# EAGLE design Osmofl2k_adapter_zmatch (EAGLE 7.5.0)
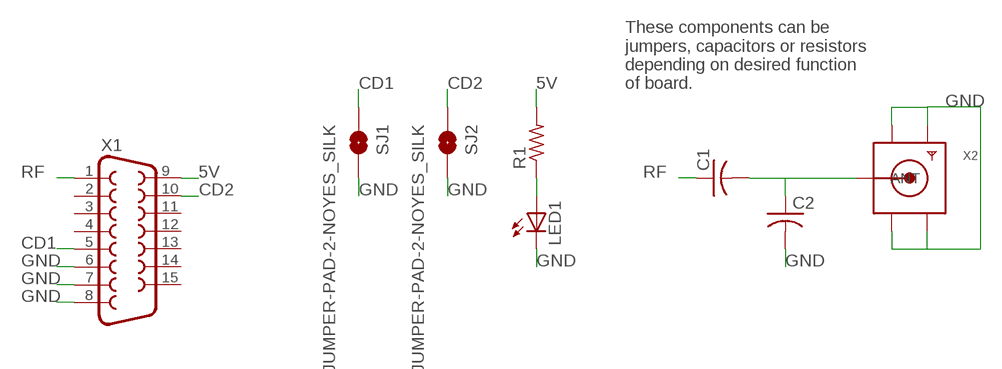
[diagram p0: schematic, sheet 1]

## Parts
C1  C-USC0603  [C0603]
C2  C-USC0603  [C0603]
LED1  LEDCHIPLED_0805  [CHIPLED_0805]
R1  R-US_R0805  [R0805]
SJ1  JUMPER-PAD-2-NOYES_SILK  [PAD-JUMPER-2-NO_YES_SILK]
SJ2  JUMPER-PAD-2-NOYES_SILK  [PAD-JUMPER-2-NO_YES_SILK]
X1  F15HDH  [HDF15H]
X2  SMACONNECTOR_EDGE  [SMA_EDGELAUNCH]

## Nets
5V: R1.2 X1.9
CD1: SJ1.1 X1.5
CD2: SJ2.1 X1.10
GND: C2.2 LED1.C SJ1.2 SJ2.2 X1.6 X1.7 X1.8 X2.GND@1(GND4) X2.GND@2(GND3) X2.GND@3(GND2) X2.GND@4(GND1)
N$1: C1.2 C2.1 X2.P(ANT)
N$2: LED1.A R1.1
RF: C1.1 X1.1
Unconnected: X1.2 X1.3 X1.4 X1.11 X1.12 X1.13 X1.14 X1.15

## Notes on the sheet
- These components can be
  jumpers, capacitors or resistors
  depending on desired function
  of board.

## Library data of the parts
C1 C2 = adafruit:C-US: CAPACITOR, American symbol
LED1 = adafruit:LED: LED OSRAM: - CHIPLED LG R971, LG N971, LY N971, LG Q971, LY Q971, LO R971, LY R971 LH N974, LH R974 LS Q976, LO Q976, LY Q976 LO Q996 - Hyper CHIPLED LW Q18S LB Q993, LB Q99A, LB R99A - SideLED LS A670, LO A670, LY A670, LG A670, LP A670 LB A673, LV A673, LT A673, LW A673 LH A674 LY A675 LS A676, LA A676, LO A676, LY A676, LW A676 LS A679, LY A679, LG A679 - Hyper Micro SIDELED® LS Y876, LA Y876, LO Y876, LY Y876 LT Y87S - SmartLED LW L88C, LW L88S LB L89C, LB L89S, LG L890 LS L89K, LO L89K, LY L89K LS L896, LA L896, LO L896, LY L896 - TOPLED LS T670, LO T670, LY T670, LG T670, LP T670 LSG T670, LSP T670, LSY T670, LOP T670, LYG T670 LG T671, LOG T671, LSG T671 LB T673, LV T673, LT T673, LW T673 LH T674 LS T676, LA T676, LO T676, LY T676, LB T676, LH T676, LSB T676, LW T676 LB T67C, LV T67C, LT T67C, LS T67K, LO T67K, LY T67K, LW E67C LS E67B, LA E67B, LO E67B, LY E67B, LB E67C, LV E67C, LT E67C LW T67C LS T679, LY T679, LG T679 LS T770, LO T770, LY T770, LG T770, LP T770 LB T773, LV T773, LT T773, LW T773 LH T774 LS E675, LA E675, LY E675, LS T675 LS T776, LA T776, LO T776, LY T776, LB T776 LHGB T686 LT T68C, LB T68C - Hyper Mini TOPLED® LB M676 - Mini TOPLED Santana® LG M470 LS M47K, LO M47K, LY M47K Source: http://www.osram.convergy.de/
R1 = adafruit:R-US_: RESISTOR, American symbol
SJ1 SJ2 = SparkFun-Passives:JUMPER-PAD-2-NO
X1 = adafruit:F15: SUB-D HDH is also known as a 'right angle VGA' connector
X2 = adafruit:SMACONNECTOR: SMA Connector 90° DIP SMA Connector, 50 Ohm (4UConnector: 07259)

## Board
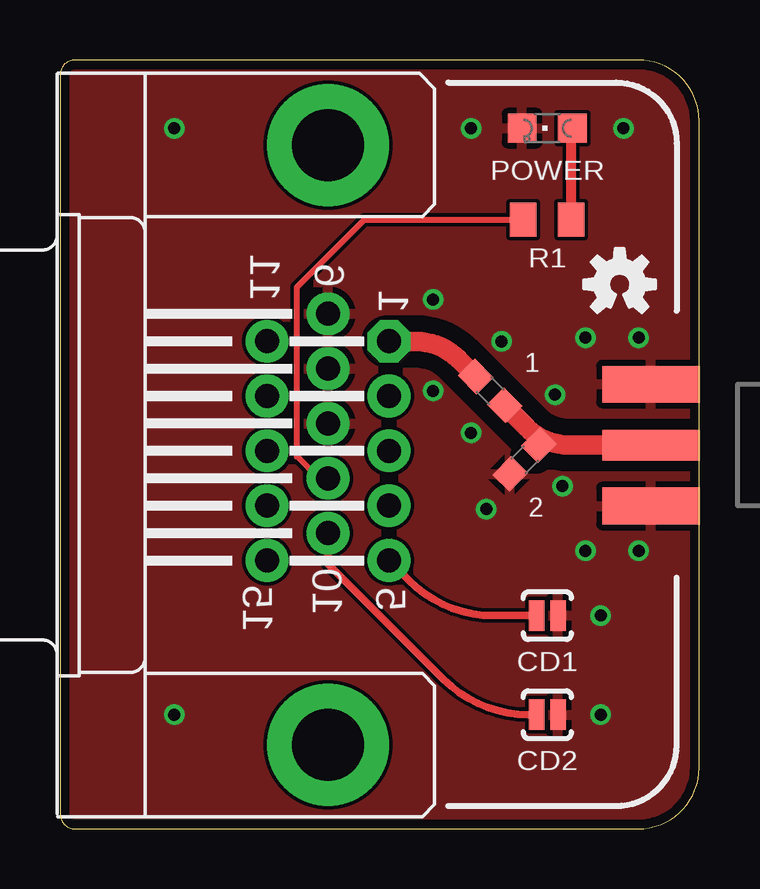
[diagram p1: board, top side]
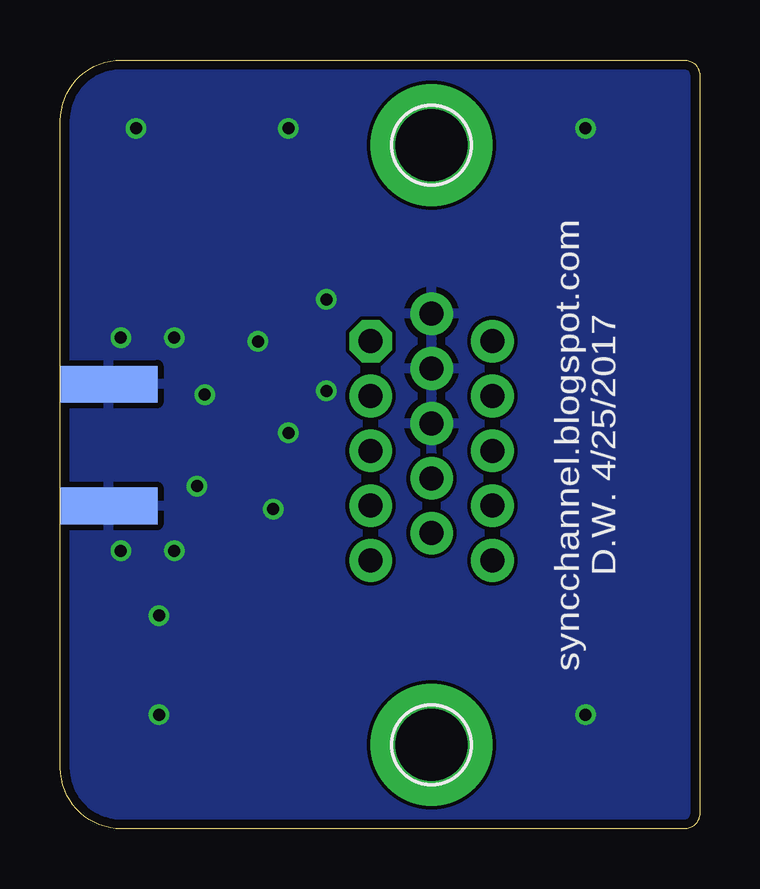
[diagram p2: board, bottom side, seen from below]

Size 26.65 x 32.05 mm. Coordinates in mm from the lower left corner, seen from the top.
Outline: 0,31.42 0,0.64 arc90 0.64,0 24.11,0 arc90 26.65,2.54 26.65,29.52 arc90 24.11,32.05 0.64,32.05 arc90 0,31.42
Copper layers (1*16): Top 0.0356mm / dielectric 1.5011mm / Bottom 0.0356mm
Design rules "LaenPCBOrder *": minimum track width 6mil, minimum drill 13mil, track to track 6mil, track to pad 6mil, pad to pad 6mil, via to via 6mil, smd to smd 6mil, copper to edge 15mil, drill to drill 6mil, minimum pad ring 7mil, minimum via ring 7mil, stop-mask expansion 3mil, vias tented up to drill 20mil, thermal gap 10mil
tRestrict: 6 lines

### Footprints (pad centres in the part's own frame; a part is rotated, then mirrored left to right if it is on the bottom)
C0603 = smd 1.1 x 1: 1 -0.85,0; 2 0.85,0
CHIPLED_0805 = smd 1.2 x 1.2: A 0,-1.05; C 0,1.05
R0805 = smd 1.1 x 1.4: 1 -1,0; 2 1,0
PAD-JUMPER-2-NO_YES_SILK = smd 0.635 x 1.27: 1 -0.45,0; 2 0.45,0
HDF15H = drill 1 pad 1.778 octagon: 1 4.329,2.54 | drill 1 pad 1.778: 2 2.043,2.54; 3 -0.243,2.54; 4 -2.529,2.54; 5 -4.815,2.54; 6 5.472,0; 7 3.186,0; 8 0.9,0; 9 -1.386,0; 10 -3.672,0; 11 4.329,-2.54; 12 2.043,-2.54; 13 -0.243,-2.54; 14 -2.529,-2.54; 15 -4.815,-2.54 | drill 3 pad 5.08: P$1 -12.5,0; P$2 12.5,0
SMA_EDGELAUNCH = smd 4.064 x 1.524: GND@1 2.032,-2.54; GND@2 2.032,2.54 | smd 4.064 x 1.524 bottom: GND@3 2.032,2.54; GND@4 2.032,-2.54 | smd 4.064 x 1.27: P 2.032,0

### Placement (x,y rotation side)
C1  17.94,18.26 315 top
C2  19.37,15.4 225 top
LED1  20.32,29.21 90 top
R1  20.32,25.4 180 top
SJ1  20.32,8.89 0 top
SJ2  20.32,4.76 0 top
U$1  [OSHW-LOGO-S]  23.34,22.7 0 top
X1  11.18,16 90 bottom
X2  26.67,16 180 top

### Tracks (layer width: path | path; a pad name or v marks a point on that pad's centre or on a via)
5V
  Top 0.254: X1.9 10.78,14.62 9.88,15.52 9.88,22.58 12.7,25.4 R1.2
CD1
  Top 0.305: SJ1.1 18.08,8.89 arc-45 14.55,10.35 X1.5
CD2
  Top 0.305: X1.10 11.18,11.05 16,6.23 arc45 19.53,4.76 SJ2.1
GND  (via drill 0.5)
  other vias: 15.56,22.07 15.56,18.26 18.41,20.32 17.14,16.51 20.64,18.1 24.13,20.48 21.91,20.48 21.91,11.59 24.13,11.59 22.54,8.89 22.54,4.76 17.14,29.21 20.95,14.29 17.78,13.34 4.76,4.76 4.76,29.21 23.5,29.21
  pour Bottom: -10.16,34.29 -10.16,-2.54 35.56,-2.54 35.56,34.29
  pour Top: -11.43,35.56 -11.43,-3.81 36.83,-3.81 36.83,35.56
N$1
  Top 0.254: C2.1 arc45 19.38,16.82 19.37,16.83
  Top 0.813: X2.P 21.25,16 arc-45 19.45,16.75 19.37,16.83 C1.2
N$2
  Top 0.406: R1.1 21.32,29.16 LED1.A
RF
  Top 0.813: C1.1 16.62,19.58 arc45 14.82,20.32 X1.1
  Top 1.27: X1.1

### Text on the board
tNames: POWER | R1 | 1 | 2 | CD1 | CD2
bNames: syncchannel.blogspot.com / D.W. 4/25/2017